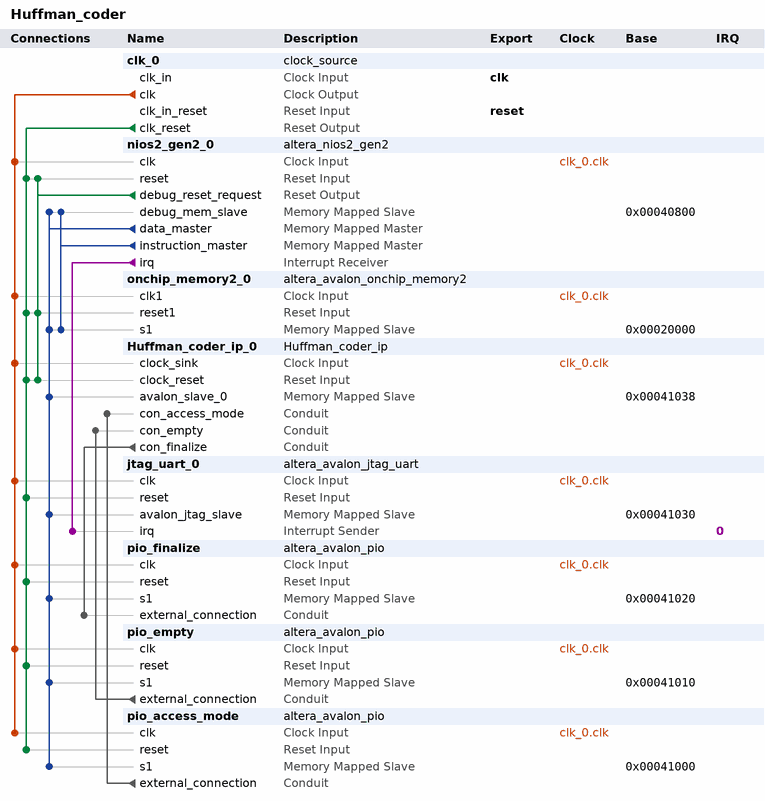
[diagram p0: system contents]
# Platform Designer (Qsys) system Huffman_coder, MAX 10 10M50DAF484C6GES
# Parameters at their usual value, and those the tool derives, are not listed.
package require -exact qsys 20.1
create_system Huffman_coder
set_project_property DEVICE_FAMILY {MAX 10}
set_project_property DEVICE 10M50DAF484C6GES

add_instance clk_0 clock_source 20.1
set_instance_parameter_value clk_0 clockFrequency 50000000

add_instance nios2_gen2_0 altera_nios2_gen2 20.1
set_instance_parameter_value nios2_gen2_0 dcache_size 2048
set_instance_parameter_value nios2_gen2_0 exceptionSlave onchip_memory2_0.s1
set_instance_parameter_value nios2_gen2_0 icache_size 4096
set_instance_parameter_value nios2_gen2_0 impl Tiny
set_instance_parameter_value nios2_gen2_0 resetSlave onchip_memory2_0.s1

add_instance onchip_memory2_0 altera_avalon_onchip_memory2 20.1
set_instance_parameter_value onchip_memory2_0 dataWidth 32
set_instance_parameter_value onchip_memory2_0 dualPort false
set_instance_parameter_value onchip_memory2_0 initMemContent true
set_instance_parameter_value onchip_memory2_0 initializationFileName /media/piko/Seagate/AGH-FPGA-labs/Huffman-coder/Huffman_coder_system/software/app/mem_init/Huffman_coder_onchip_memory2_0.hex
set_instance_parameter_value onchip_memory2_0 memorySize 70536
set_instance_parameter_value onchip_memory2_0 useNonDefaultInitFile true

add_instance Huffman_coder_ip_0 Huffman_coder_ip 2.0

add_instance jtag_uart_0 altera_avalon_jtag_uart 20.1
set_instance_parameter_value jtag_uart_0 simInteractiveOptions NO_INTERACTIVE_WINDOWS

add_instance pio_finalize altera_avalon_pio 20.1
set_instance_parameter_value pio_finalize direction Output
set_instance_parameter_value pio_finalize width 1

add_instance pio_empty altera_avalon_pio 20.1
set_instance_parameter_value pio_empty direction Input
set_instance_parameter_value pio_empty width 1

add_instance pio_access_mode altera_avalon_pio 20.1
set_instance_parameter_value pio_access_mode direction Output
set_instance_parameter_value pio_access_mode width 1

# connections
add_connection clk_0.clk Huffman_coder_ip_0.clock_sink clock
add_connection clk_0.clk jtag_uart_0.clk clock
add_connection clk_0.clk nios2_gen2_0.clk clock
add_connection clk_0.clk onchip_memory2_0.clk1 clock
add_connection clk_0.clk pio_access_mode.clk clock
add_connection clk_0.clk pio_empty.clk clock
add_connection clk_0.clk pio_finalize.clk clock
add_connection clk_0.clk_reset Huffman_coder_ip_0.clock_reset reset
add_connection clk_0.clk_reset jtag_uart_0.reset reset
add_connection clk_0.clk_reset nios2_gen2_0.reset reset
add_connection clk_0.clk_reset onchip_memory2_0.reset1 reset
add_connection clk_0.clk_reset pio_access_mode.reset reset
add_connection clk_0.clk_reset pio_empty.reset reset
add_connection clk_0.clk_reset pio_finalize.reset reset
add_connection nios2_gen2_0.debug_reset_request Huffman_coder_ip_0.clock_reset reset
add_connection nios2_gen2_0.debug_reset_request nios2_gen2_0.reset reset
add_connection nios2_gen2_0.debug_reset_request onchip_memory2_0.reset1 reset
add_connection nios2_gen2_0.data_master Huffman_coder_ip_0.avalon_slave_0 avalon
set_connection_parameter_value nios2_gen2_0.data_master/Huffman_coder_ip_0.avalon_slave_0 baseAddress 0x00041038
add_connection nios2_gen2_0.data_master jtag_uart_0.avalon_jtag_slave avalon
set_connection_parameter_value nios2_gen2_0.data_master/jtag_uart_0.avalon_jtag_slave baseAddress 0x00041030
add_connection nios2_gen2_0.data_master nios2_gen2_0.debug_mem_slave avalon
set_connection_parameter_value nios2_gen2_0.data_master/nios2_gen2_0.debug_mem_slave baseAddress 0x00040800
add_connection nios2_gen2_0.data_master onchip_memory2_0.s1 avalon
set_connection_parameter_value nios2_gen2_0.data_master/onchip_memory2_0.s1 baseAddress 0x00020000
add_connection nios2_gen2_0.data_master pio_access_mode.s1 avalon
set_connection_parameter_value nios2_gen2_0.data_master/pio_access_mode.s1 baseAddress 0x00041000
add_connection nios2_gen2_0.data_master pio_empty.s1 avalon
set_connection_parameter_value nios2_gen2_0.data_master/pio_empty.s1 baseAddress 0x00041010
add_connection nios2_gen2_0.data_master pio_finalize.s1 avalon
set_connection_parameter_value nios2_gen2_0.data_master/pio_finalize.s1 baseAddress 0x00041020
add_connection nios2_gen2_0.instruction_master nios2_gen2_0.debug_mem_slave avalon
set_connection_parameter_value nios2_gen2_0.instruction_master/nios2_gen2_0.debug_mem_slave baseAddress 0x00040800
add_connection nios2_gen2_0.instruction_master onchip_memory2_0.s1 avalon
set_connection_parameter_value nios2_gen2_0.instruction_master/onchip_memory2_0.s1 baseAddress 0x00020000
add_connection Huffman_coder_ip_0.con_finalize pio_finalize.external_connection conduit
add_connection pio_access_mode.external_connection Huffman_coder_ip_0.con_access_mode conduit
add_connection pio_empty.external_connection Huffman_coder_ip_0.con_empty conduit
add_connection nios2_gen2_0.irq jtag_uart_0.irq interrupt
set_connection_parameter_value nios2_gen2_0.irq/jtag_uart_0.irq irqNumber 0

# exported interfaces
add_interface clk clock sink
set_interface_property clk EXPORT_OF clk_0.clk_in
add_interface reset reset sink
set_interface_property reset EXPORT_OF clk_0.clk_in_reset

set_interconnect_requirement {$system} qsys_mm.clockCrossingAdapter HANDSHAKE
set_interconnect_requirement {$system} qsys_mm.enableEccProtection FALSE
set_interconnect_requirement {$system} qsys_mm.insertDefaultSlave FALSE
set_interconnect_requirement {$system} qsys_mm.maxAdditionalLatency 1

save_system Huffman_coder.qsys
